# Altium project AutoReverseAVR.PrjPCB
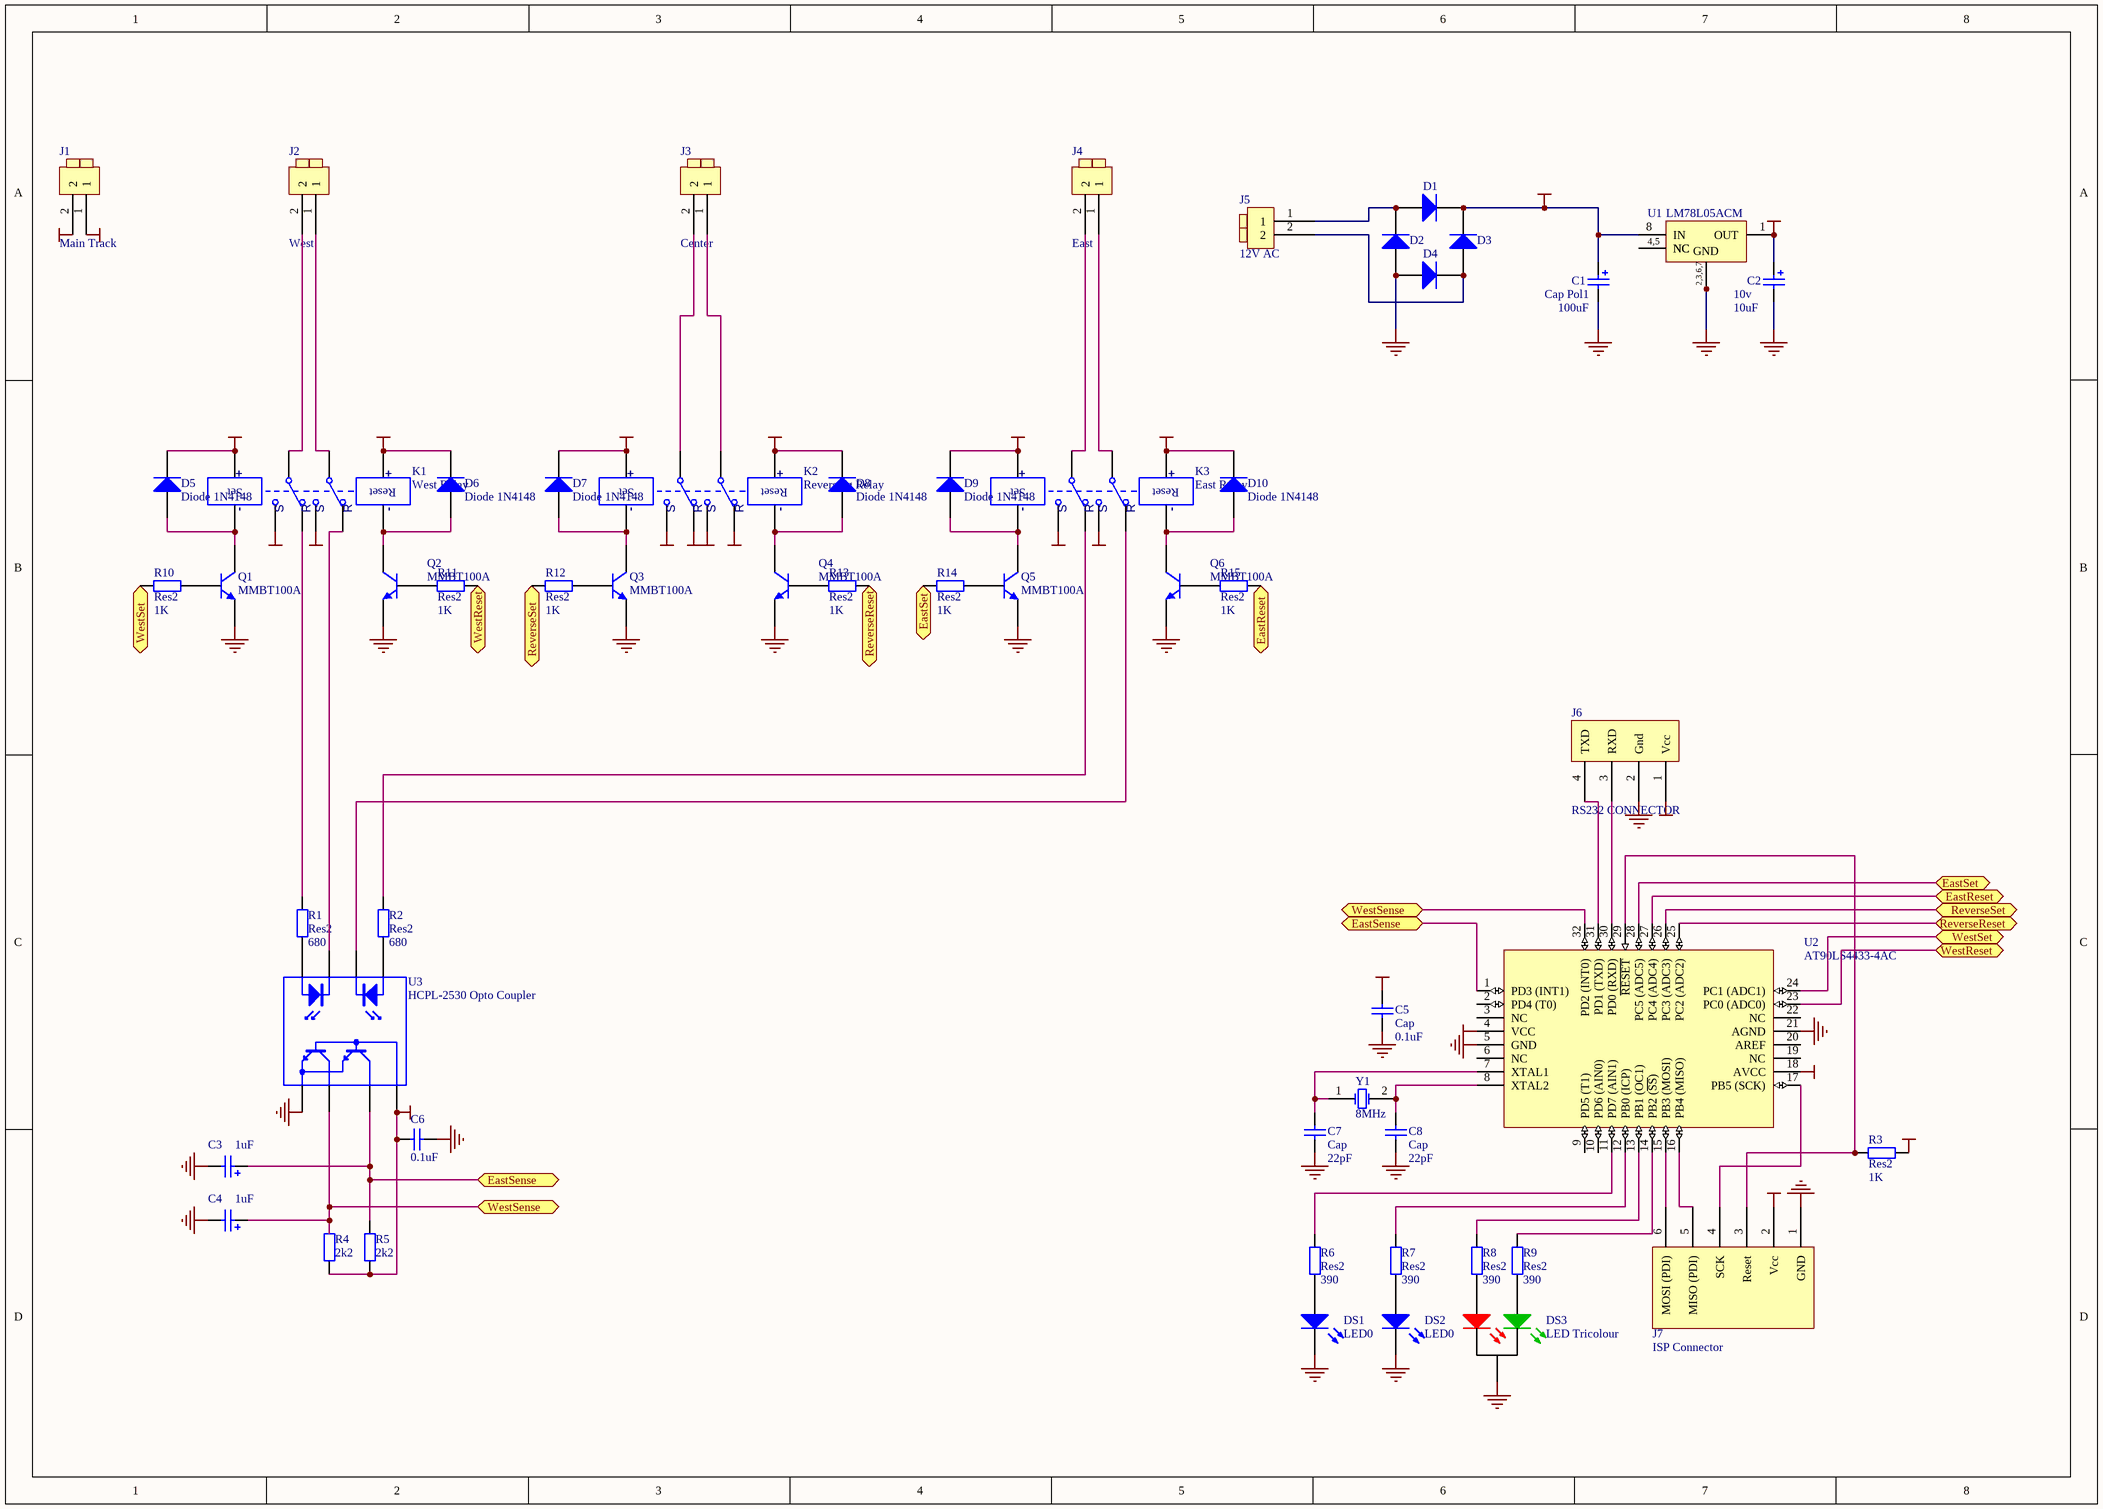
[diagram p0: AutoReverseAVR2.SchDoc]
1 sheet, 56 parts. Net scope: flat (ports and power ports of the same name join across sheets).
Board file: AutoReverseAVR2.PcbDoc

## Sheet AutoReverseAVR2.SchDoc
size A3

### Parts
C1  Cap Pol1  value 100uF  [CAPPR5-10X10.5]
C2  10v  value 10uF  [CC3216-1206]
C3  value 1uF  [CC3216-1206]  (hidden comment: Cap Pol1)
C4  value 1uF  [CC3216-1206]  (hidden comment: Cap Pol1)
C5  Cap  value 0.1uF  [CC2012-0805]
C6  value 0.1uF  [CC2012-0805]  (hidden comment: Cap)
C7  Cap  value 22pF  [CC2012-0805]
C8  Cap  value 22pF  [CC2012-0805]
D1  Diode 1N4004  [DIO10.46-5.3x2.8]  (value not drawn)
D2  Diode 1N4004  [DIO10.46-5.3x2.8]  (value not drawn)
D3  Diode 1N4004  [DIO10.46-5.3x2.8]  (value not drawn)
D4  Diode 1N4004  [DIO10.46-5.3x2.8]  (value not drawn)
D5  Diode 1N4148  [DIO7.1-3.9x1.9]
D6  Diode 1N4148  [DIO7.1-3.9x1.9]
D7  Diode 1N4148  [DIO7.1-3.9x1.9]
D8  Diode 1N4148  [DIO7.1-3.9x1.9]
D9  Diode 1N4148  [DIO7.1-3.9x1.9]
D10  Diode 1N4148  [DIO7.1-3.9x1.9]
DS1  LED0  [LED3mm]
DS2  LED0  [LED3mm]
DS3  LED Tricolour  [LED3mm TriColour]
J1  Main Track  [Screw Terminal 2 way 0.2]
J2  West  [Screw Terminal 2 way 0.2]
J3  Center  [Screw Terminal 2 way 0.2]
J4  East  [Screw Terminal 2 way 0.2]
J5  12V AC  [Screw Terminal 2 way 0.2]
J6  RS232 CONNECTOR  [0.1 SIP 4 PIN]
J7  ISP Connector  [0.1 SIP 6 PIN]
K1  West Relay  [DIP-10]
K2  Reversing Relay  [DIP-10]
K3  East Relay  [DIP-10]
Q1  MMBT100A  [SO-G3]
Q2  MMBT100A  [SO-G3]
Q3  MMBT100A  [SO-G3]
Q4  MMBT100A  [SO-G3]
Q5  MMBT100A  [SO-G3]
Q6  MMBT100A  [SO-G3]
R1  Res2  value 680  [CR2012-0805]
R2  Res2  value 680  [CR2012-0805]
R3  Res2  value 1K  [CR2012-0805]
R4  value 2k2  [CR2012-0805]  (hidden comment: Res2)
R5  value 2k2  [CR2012-0805]  (hidden comment: Res2)
R6  Res2  value 390  [CR2012-0805]
R7  Res2  value 390  [CR2012-0805]
R8  Res2  value 390  [CR2012-0805]
R9  Res2  value 390  [CR2012-0805]
R10  Res2  value 1K  [CR2012-0805]
R11  Res2  value 1K  [CR2012-0805]
R12  Res2  value 1K  [CR2012-0805]
R13  Res2  value 1K  [CR2012-0805]
R14  Res2  value 1K  [CR2012-0805]
R15  Res2  value 1K  [CR2012-0805]
U1  LM78L05ACM  [M08A]
U2  AT90LS4433-4AC  [32A]
U3  HCPL-2530 Opto Coupler  [8P3]
Y1  8MHz  [RAD-0.2]

### Ports
EastReset (bidir), EastSense (bidir), EastSet (bidir), ReverseReset (bidir), ReverseSet (bidir), WestReset (bidir), WestSense (bidir), WestSet (bidir)

### Nets
A: J1.2 K1.7(S) K2.2(R) K2.7(S) K3.7(S)
B: J1.1 K1.4(S) K2.4(S) K2.9(R) K3.4(S)
GND: C1.2 C2.2 C3.2 C4.2 C5.1 C6.2 C7.1 C8.1 D2.1(A) D4.1(A) DS1.2(K) DS2.2(K) DS3.2(K) J6.2(Gnd) J7.1(GND) Q1.2(E) Q2.2(E) Q3.2(E) Q4.2(E) Q5.2(E) Q6.2(E) U1.2(GND) U1.3(GND) U1.6(GND) U1.7(GND) U2.5(GND) U2.21(AGND) U3.5(E)
VCC: C2.1 C5.2 C6.1 J6.1(Vcc) J7.2(Vcc) R3.1 R4.2 R5.2 U1.1(OUT) U2.4(VCC) U2.18(AVCC) U3.8(E)
Vdd: C1.1 D1.2(K) D3.2(K) D5.2(K) D6.2(K) D7.2(K) D8.2(K) D9.2(K) D10.2(K) K1.1 K1.10 K2.1 K2.10 K3.1 K3.10 U1.8(IN)
NetC3_1: C3.1 R5.1 U2.1(PD3_(INT1)) U3.7(C) ; port EastSense
NetC4_1: C4.1 R4.1 U2.32(PD2_(INT0)) U3.6(C) ; port WestSense
NetC7_2: C7.2 U2.7(XTAL1) Y1.1(OSC1)
NetC8_2: C8.2 U2.8(XTAL2) Y1.2(OSC2)
NetD1_1: D1.1(A) D2.2(K) J5.1
NetD3_1: D3.1(A) D4.2(K) J5.2
NetD5_1: D5.1(A) K1.5 Q1.3(C)
NetD6_1: D6.1(A) K1.6 Q2.3(C)
NetD7_1: D7.1(A) K2.5 Q3.3(C)
NetD8_1: D8.1(A) K2.6 Q4.3(C)
NetD9_1: D9.1(A) K3.5 Q5.3(C)
NetD10_1: D10.1(A) K3.6 Q6.3(C)
NetDS1_1: DS1.1(A) R6.1
NetDS2_1: DS2.1(A) R7.1
NetDS3_1: DS3.1(Ag) R9.1
NetDS3_3: DS3.3(Ar) R8.1
NetJ2_1: J2.1 K1.3
NetJ2_2: J2.2 K1.8
NetJ3_1: J3.1 K2.3
NetJ3_2: J3.2 K2.8
NetJ4_1: J4.1 K3.3
NetJ4_2: J4.2 K3.8
NetJ6_3: J6.3(RXD) U2.30(PD0_(RXD))
NetJ6_4: J6.4(TXD) U2.31(PD1_(TXD))
NetJ7_3: J7.3(Reset) R3.2 U2.29(~{RESET})
NetJ7_4: J7.4(SCK) U2.17(PB5_(SCK))
NetJ7_5: J7.5(MISO_(PDI)) U2.16(PB4_(MISO))
NetJ7_6: J7.6(MOSI_(PDI)) U2.15(PB3_(MOSI))
NetK1_2: K1.2(R) U3.3(K)
NetK1_9: K1.9(R) R1.2
NetK3_2: K3.2(R) U3.2(K)
NetK3_9: K3.9(R) R2.2
NetQ1_1: Q1.1(B) R10.1
NetQ2_1: Q2.1(B) R11.1
NetQ3_1: Q3.1(B) R12.1
NetQ4_1: Q4.1(B) R13.1
NetQ5_1: Q5.1(B) R14.1
NetQ6_1: Q6.1(B) R15.1
NetR1_1: R1.1 U3.4(A)
NetR2_1: R2.1 U3.1(A)
NetR6_2: R6.2 U2.11(PD7_(AIN1))
NetR7_2: R7.2 U2.12(PB0_(ICP))
NetR8_2: R8.2 U2.13(PB1_(OC1))
NetR9_2: R9.2 U2.14(PB2_(~{SS}))
NetR10_2: R10.2 U2.24(PC1_(ADC1)) ; port WestSet
NetR11_2: R11.2 U2.23(PC0_(ADC0)) ; port WestReset
NetR12_2: R12.2 U2.26(PC3_(ADC3)) ; port ReverseSet
NetR13_2: R13.2 U2.25(PC2_(ADC2)) ; port ReverseReset
NetR14_2: R14.2 U2.28(PC5_(ADC5)) ; port EastSet
NetR15_2: R15.2 U2.27(PC4_(ADC4)) ; port EastReset
NetU1_4: U1.4(NC) U1.5(NC)

Not connected (* = marked no-connect by the designer): U2 2(PD4_(T0)) 3(NC) 6(NC) 9(PD5_(T1)) 10(PD6_(AIN0)) 19(NC) 20(AREF) 22(NC)

### Notes on the sheet
- (in symbol EA2-5T Dual Coil 5V Latching Relay) +; Set; Reset; -
- (in symbol LM78L05ACM) 4,5; 2,3,6,7

### Library data of the parts
C1-C4 = Cap Pol1: Polarized Capacitor (Radial); Published: 8-Jun-2000; Revision: July-2002: Re-released for DXP Platform.; Publisher: Altium Limited
C5-C8 = Cap: Capacitor; Published: 8-Jun-2000; Revision: July-2002: Re-released for DXP Platform.; Publisher: Altium Limited
D1-D4 = Diode 1N4004: 1 Amp General Purpose Rectifier; Revision 1: 11-Jul-2000: SIM Model Added.; Revision 2: 17-Jul-2002: Re-released for DXP Platform.; Package Information: Latest Revision: Aug-1999; Code - JEDEC: DO-204-AL; Published: 8-Jun-2000; Datasheet: Latest Revision: 1998; Package Reference: DO-41; Publisher: Altium Limited
D5-D10 = Diode 1N4148: High Conductance Fast Diode; Revision 1: 11-Jul-2000: SIM Model Added.; Revision 2: 17-Jul-2002: Re-released for DXP Platform.; Code - JEDEC: DO-204-AH; Published: 8-Jun-2000; Datasheet: Latest Revision: 1997; Package Reference: DO-35; Publisher: Altium Limited
DS1 DS2 = LED0: Typical INFRARED GaAs LED; Published: 8-Jun-2000; Revision: July-2002: Re-released for DXP Platform.; Publisher: Altium Limited
DS3 = LED Tricolour: Typical Red Green Tri Color LED; Published: 8-Jun-2000; Revision: July-2002: Re-released for DXP Platform.; Publisher: Altium Limited
J1-J5 = Screw Terminal 2 Way
K1-K3 = EA2-5T Dual Coil 5V Latching Relay: Published: 24-Mar-1999; Revision: July-2002: Re-released for DXP Platform.; Publisher: Altium Limited
Q1-Q6 = MMBT100A: General Purpose Amplifier NPN Silicon; Package Information: Latest Revision: 1997; Published: 29-Sep-2000; Revision: 17-Jul-2002: Re-released for DXP Platform.; Datasheet: Latest Revision: 1996; Package Reference: 318-08; Publisher: Altium Limited
R1-R15 = Res2: Resistor; Published: 8-Jun-2000; Revision: July-2002: Re-released for DXP Platform.; Publisher: Altium Limited
U1 = LM78L05ACM: 3-Terminal Positive Regulator; Package Information: Latest Revision: Sep-1997; Code - JEDEC: MS-012-AA; Code - IPC: SO8; Published: 15-Apr-2002; Revision: 17-Sep-2003: Changed SIM name.; Datasheet: Latest Revision: Sep-1999; Package Reference: M08A; Publisher: Altium Limited
U2 = AT90LS4433-4AC: 8-Bit AVR Microcontroller with 4K Bytes of In-System Programmable Flash Memory; Package Information: Latest Revision: revB, Oct-2001; Code - JEDEC: MS-026-ABA; Published: 17-Sep-2003; Datasheet: Latest Revision: 1042G-AVR-09/02; Package Reference: 32A; Publisher: Altium Limited
U3 = HCPL-2530
Y1 = XTAL: Crystal Oscillator; Published: 8-Jun-2000; Revision: July-2002: Re-released for DXP Platform.; Publisher: Altium Limited